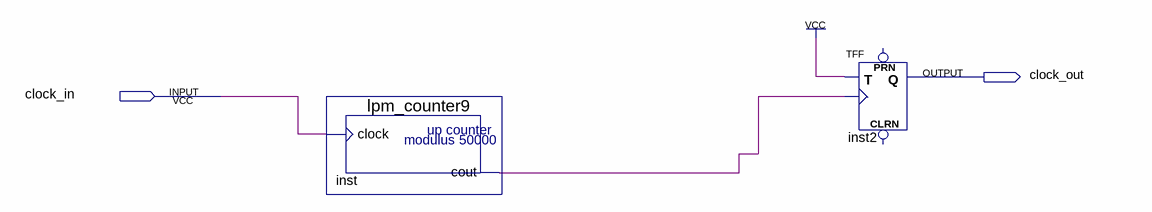
[diagram p0: schematic sheet]
// Quartus schematic Divisor_de_clock2.bdf as structural Verilog: 2 symbols, 2 pins
module Divisor_de_clock2 (
  input  clock_in,
  output clock_out
);

  wire inst_cout;

  lpm_counter9 inst (.clock(clock_in), .cout(inst_cout));
  TFF inst2 (.T(1'b1), .CLK(inst_cout), .Q(clock_out));  // open: PRN, CLRN
endmodule
